# Altium schematic sheet USB_PWR_SWITCH_DUAL_AP2152.SchDoc
size A3; SheetNumber: 16; SheetTotal: 22
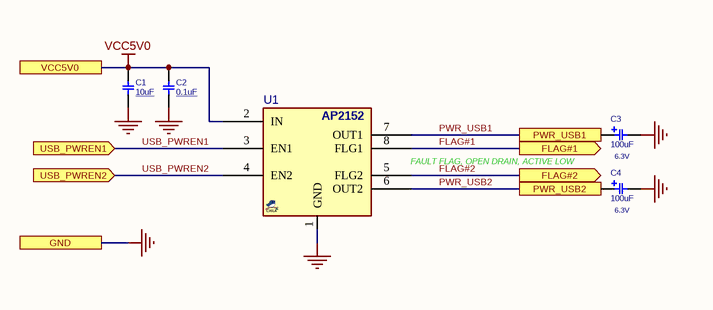
[diagram p0: USB_PWR_SWITCH_DUAL_AP2152.SchDoc]

## Parts
C1  10uF  [C0603]
C2  0.1uF  [C0402]
C3  PARAM2: 6.3V  [C_TN_3528]  (hidden comment: 100uF)
C4  PARAM2: 6.3V  [C_TN_3528]  (hidden comment: 100uF)
U1  AP2152  [SO_8]  (value not drawn)

## Ports
FLAG#1 (out), FLAG#2 (out), GND, PWR_USB1, PWR_USB2, USB_PWREN1 (in), USB_PWREN2 (in), VCC5V0

## Nets
GND: C1.2 C2.2 C3.2 C4.2 U1.1(GND) ; port GND
VCC5V0: C1.1 C2.1 U1.2(IN) ; port VCC5V0
FLAG#1: U1.8(FLG1) ; port FLAG#1
FLAG#2: U1.5(FLG2) ; port FLAG#2
PWR_USB1: C3.1 U1.7(OUT1) ; port PWR_USB1
PWR_USB2: C4.1 U1.6(OUT2) ; port PWR_USB2
USB_PWREN1: U1.3(EN1) ; port USB_PWREN1
USB_PWREN2: U1.4(EN2) ; port USB_PWREN2

## Notes on the sheet
- FAULT FLAG, OPEN DRAIN, ACTIVE LOW

## Library data of the parts
C1 = CAP_SMD_MLCC: CAP, MLCC; PARAM: X5R, 20%; MANF_P#: CL05A106MP5NUNC; MANF: Samsung; PARAM2: 10v; PRICE: 10,000: $0.028; ASSEMBLY: ASSEMBLY; VALUE: 10uF
C2 = CAP_SMD_MLCC: CAP, MLCC; PARAM: X5R, 10%; MANF_P#: GRM155R61E104; MANF: Murata; PARAM2: 25v; PRICE: 10,000:$0.006; ASSEMBLY: ASSEMBLY; VALUE: 0.1uF
C3 C4 = CAP_SMD_TAN_3528: CAP, SMD, TAN,; VALUE: 100uF
U1 = AP2152_SOP8: LOAD SW, Dual Port USB, Over-Current Protection; MANF: Diodes; MANF_P#: AP2152SG-13; PARAM: Dual 0.5A; PRICE: 0.5$; VALUE: AP2152